# Altium schematic sheet RS232.SchDoc
size A; SheetNumber: 4; SheetTotal: 4
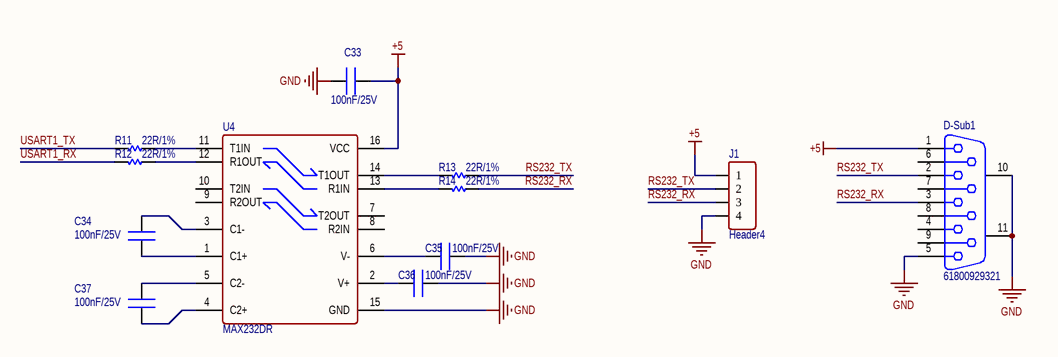
[diagram p0: RS232.SchDoc]

## Parts
C33  100nF/25V  [CN-SMD-0603]
C34  100nF/25V  [CN-SMD-0603]
C35  100nF/25V  [CN-SMD-0603]
C36  100nF/25V  [CN-SMD-0603]
C37  100nF/25V  [CN-SMD-0603]
D-Sub1  61800929321  [COM9E]
J1  Header4  [XH2.54-4-DIP]
R11  22R/1%  [RES-SMD-0603]
R12  22R/1%  [RES-SMD-0603]
R13  22R/1%  [RES-SMD-0603]
R14  22R/1%  [RES-SMD-0603]
U4  MAX232DR  [SO16]

## Nets
+5: C33.1 D-Sub1.1 J1.1 U4.16(VCC)
GND: C33.2 C35.1 C36.1 D-Sub1.5 D-Sub1.10(MH1) D-Sub1.11(MH2) J1.4 U4.15(GND)
RS232_RX: D-Sub1.3 J1.3 R14.1
RS232_TX: D-Sub1.2 J1.2 R13.1
USART1_RX: R12.2
USART1_TX: R11.2
NetC34_1: C34.1 U4.1(C1+)
NetC34_2: C34.2 U4.3(C1-)
NetC35_2: C35.2 U4.6(V-)
NetC36_2: C36.2 U4.2(V+)
NetC37_1: C37.1 U4.4(C2+)
NetC37_2: C37.2 U4.5(C2-)
NetR11_1: R11.1 U4.11(T1IN)
NetR12_1: R12.1 U4.12(R1OUT)
NetR13_2: R13.2 U4.14(T1OUT)
NetR14_2: R14.2 U4.13(R1IN)

Not connected (* = marked no-connect by the designer): D-Sub1 4 6 7 8 9; U4 7(T2OUT) 8(R2IN) 9(R2OUT) 10(T2IN)

## Library data of the parts
C33-C37 = CN: CL10B104KA8NNNC; PN: CL10B104KA8NNNC
D-Sub1 = CON 9BD: Manufacturer: Würth Elektronik eiSos GmbH; PN: 61800929321; ComponentLink1Description: Manufacturer; ComponentLink1URL: http://www.we-online.de; Created by: Christin Zierenner; Created Date: May 2012; ComponentLink2Description: Datasheet; ComponentLink2URL: http://katalog.we-online.de/kataloge/eisos/index.php?language=en&pf=Filter_gerade
J1 = Header4: Connector 4; Manufacturer: W¨¹rth Elektronik eiSos GmbH; partNo: 613002143121; ComponentLink1 Description: Manufacturer; ComponentLink2 Description: Datasheet; NoPins: 02; Created Date: 29 March 2013; ComponentLink1URL: http://www.we-online.com; ComponentLink2URL: http://katalog.we-online.de/em/datasheet/6130xx143121.pdf; Created by: Karrer Zheng
R11-R14 = Res-SMD: ERJ-3EKF22R0V; PN: ERJ-3EKF22R0V
U4 = MAX3232: PN: MAX232DR